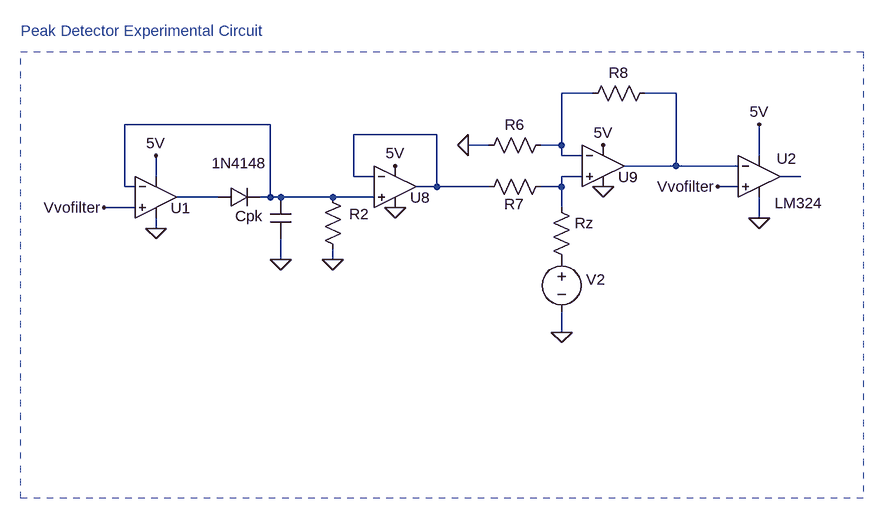
[diagram p0: schematic Peak Detector.asc]
Peak Detector.asc, the LTspice schematic file:
Version 4
SHEET 1 3756 1488
WIRE 224 -208 176 -208
WIRE 352 -208 304 -208
WIRE -272 -160 -496 -160
WIRE -16 -144 -144 -144
WIRE 64 -128 32 -128
WIRE 176 -128 176 -208
WIRE 176 -128 144 -128
WIRE 176 -112 176 -128
WIRE 208 -112 176 -112
WIRE 480 -112 480 -160
WIRE 352 -96 352 -208
WIRE 352 -96 272 -96
WIRE 448 -96 352 -96
WIRE -448 -80 -448 -112
WIRE -144 -80 -144 -144
WIRE -112 -80 -144 -80
WIRE 208 -80 176 -80
WIRE 544 -80 512 -80
WIRE -496 -64 -496 -160
WIRE -480 -64 -496 -64
WIRE -16 -64 -16 -144
WIRE -16 -64 -48 -64
WIRE 64 -64 -16 -64
WIRE 176 -64 176 -80
WIRE 176 -64 144 -64
WIRE 448 -64 416 -64
WIRE -352 -48 -416 -48
WIRE -272 -48 -272 -160
WIRE -272 -48 -288 -48
WIRE -256 -48 -272 -48
WIRE -176 -48 -256 -48
WIRE -112 -48 -176 -48
WIRE -480 -32 -528 -32
WIRE 176 -32 176 -64
WIRE 480 -16 480 -48
WIRE -448 0 -448 -16
WIRE -256 48 -256 16
WIRE -176 48 -176 32
WIRE 176 160 176 128
FLAG -256 48 0
FLAG -176 48 0
FLAG -528 -32 Vvofilter
FLAG -448 -112 5V
FLAG -448 0 0
FLAG 480 -16 0
FLAG 480 -160 5V
FLAG 240 -64 0
FLAG 240 -128 5V
FLAG 32 -128 0
FLAG -80 -32 0
FLAG -80 -96 5V
FLAG 176 160 0
FLAG 416 -64 Vvofilter
SYMBOL diode -352 -32 R270
WINDOW 0 33 24 Invisible 2
WINDOW 3 84 32 VBottom 2
SYMATTR InstName Dpk
SYMATTR Value 1N4148
SYMBOL cap -272 -48 R0
WINDOW 0 -54 29 Left 2
WINDOW 3 24 56 Invisible 2
SYMATTR InstName Cpk
SYMATTR Value 1µ
SYMATTR SpiceLine Rser=0.001
SYMBOL res -192 -64 R0
WINDOW 0 41 42 Left 2
WINDOW 3 36 76 Invisible 2
SYMATTR InstName R2
SYMATTR Value 10k
SYMBOL Opamps/opamp2 -448 -112 R0
WINDOW 0 23 81 Left 2
WINDOW 3 24 105 Invisible 2
SYMATTR InstName U1
SYMATTR Value LM324
SYMBOL Opamps/opamp2 480 -144 R0
WINDOW 0 27 37 Left 2
WINDOW 3 24 105 Left 2
SYMATTR InstName U2
SYMATTR Value LM324
SYMBOL Opamps/opamp2 240 -160 R0
WINDOW 0 23 81 Left 2
WINDOW 3 24 105 Invisible 2
SYMATTR InstName U9
SYMATTR Value LM324
SYMBOL res 160 -80 R90
WINDOW 0 58 57 VBottom 2
WINDOW 3 52 57 Invisible 2
SYMATTR InstName R7
SYMATTR Value 10k
SYMBOL res 160 -144 R90
WINDOW 0 0 56 VBottom 2
WINDOW 3 -47 54 Invisible 2
SYMATTR InstName R6
SYMATTR Value 10k
SYMBOL res 320 -224 R90
WINDOW 0 0 56 VBottom 2
WINDOW 3 32 56 Invisible 2
SYMATTR InstName R8
SYMATTR Value 10k
SYMBOL res 160 -48 R0
WINDOW 3 36 76 Invisible 2
SYMATTR Value 10k
SYMATTR InstName Rz
SYMBOL Opamps/opamp2 -80 -128 R0
WINDOW 0 23 81 Left 2
WINDOW 3 24 105 Invisible 2
SYMATTR InstName U8
SYMATTR Value LM324
SYMBOL voltage 176 32 R0
WINDOW 123 0 0 Left 0
WINDOW 39 0 0 Left 0
WINDOW 0 38 47 Left 2
WINDOW 3 24 96 Invisible 2
SYMATTR InstName V2
SYMATTR Value 0.3V
TEXT -656 -304 Left 2 ;Peak Detector Experimental Circuit
RECTANGLE Normal 640 416 -656 -272 1

The netlist it stands for:
* Peak Detector.asc
Dpk N007 N003 1N4148
Cpk N003 0 1µ Rser=0.001
R2 N003 0 10k
XU1 Vvofilter N003 5V 0 N007 LM324  ; pins In+ In- V+ V- OUT
XU2 Vvofilter N002 5V 0 N006 LM324  ; pins In+ In- V+ V- OUT
XU9 N005 N001 5V 0 N002 LM324  ; pins In+ In- V+ V- OUT
R7 N005 N004 10k
R6 N001 0 10k
R8 N002 N001 10k
Rz N005 P001 10k
XU8 N003 N004 5V 0 N004 LM324  ; pins In+ In- V+ V- OUT
V2 P001 0 0.3V
.model D D
.lib standard.dio
* Peak Detector Experimental Circuit
.backanno
.end